# Altium project ELLO 2M.PrjPcb
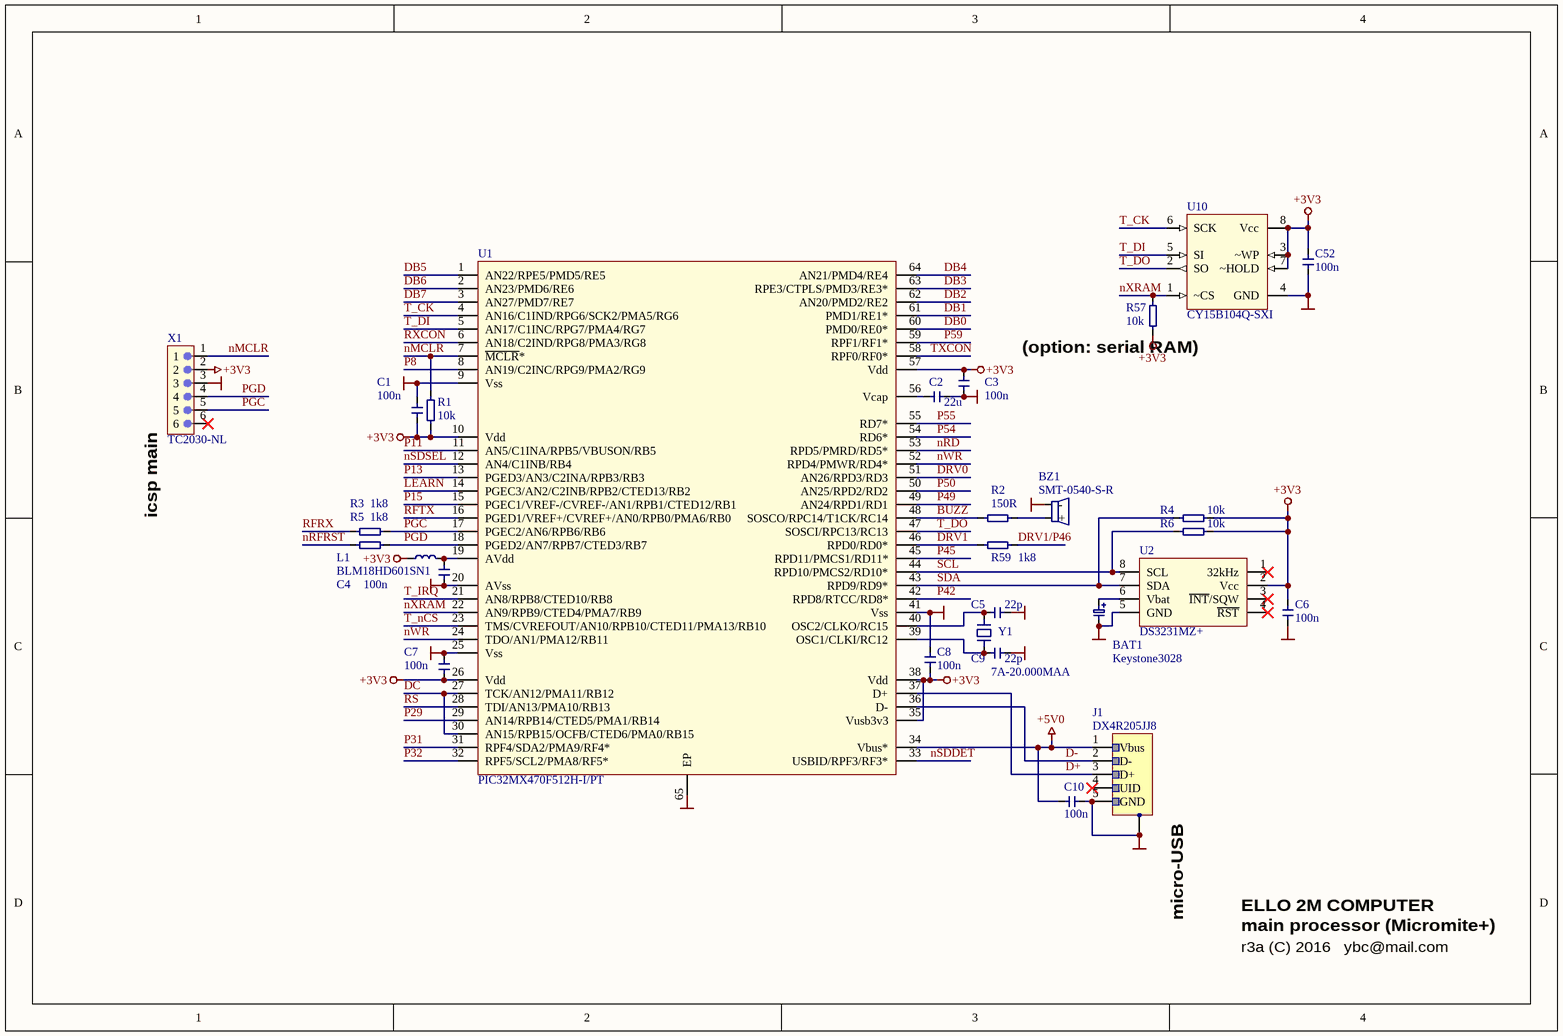
[diagram p0: main.SchDoc]
4 sheets, 231 parts. Net scope: global (net labels, ports and power ports of the same name join across sheets).
Board file: PCB1.PcbDoc
Sheets:
  main.SchDoc
  expansions.SchDoc
  keyboard.SchDoc
  video.SchDoc

## Sheet main.SchDoc
size A4

### Parts
BAT1  Keystone3028  [KEYSTONE3028/34]
BZ1  SMT-0540-S-R  [SMT-0540-S-R]
C1  100n  [_0603]
C2  22u  [_1206]
C3  100n  [_0603]
C4  100n  [_0603]
C5  22p  [_0603]
C6  100n  [_0603]
C7  100n  [_0603]
C8  100n  [_0603]
C9  22p  [_0603]
C10  100n  [_0603]
C52  100n  [_0603]
J1  DX4R205JJ8  [DX4R205JJ8]
L1  BLM18HD601SN1  [_0603]
R1  10k  [_0603]
R2  150R  [_0603]
R3  1k8  [_0603]
R4  10k  [_0603]
R5  1k8  [_0603]
R6  10k  [_0603]
R57  10k  [_0603]
R59  1k8  [_0603]
U1  PIC32MX470F512H-I/PT  [QFP50P1200X1200X120-65N-S600]
U2  DS3231MZ+  [SOIC8]
U10  CY15B104Q-SXI  [SOIC127P790X216-8N]
X1  TC2030-NL  [TC2030-NL]  (no BOM)
Y1  7A-20.000MAA  [Crystal 50x32 (2)]

### Nets
+3V3: C1.2 C3.1 C6.1 C7.2 C8.2 C52.2 L1.1 R1.1 R4.2 R6.2 R57.1 U1.10(Vdd) U1.26(Vdd) U1.35(Vusb3v3) U1.38(Vdd) U1.57(Vdd) U2.2(Vcc) U10.3(~WP) U10.7(~HOLD) U10.8(Vcc) X1.2
+5V0: C10.2 J1.1(Vbus) U1.34(Vbus*)
GND: BAT1.- BZ1.2(-) C1.1 C2.1 C3.2 C4.2 C5.2 C6.2 C7.1 C8.1 C9.2 C10.1 C52.1 J1.5(GND) U1.9(Vss) U1.20(AVss) U1.25(Vss) U1.41(Vss) U1.65(EP) U2.5(GND) U10.4(GND) X1.3
BUZZ: R2.1 U1.48(SOSCO/RPC14/T1CK/RC14)
D+: J1.3(D+) U1.37(D+)
D-: J1.2(D-) U1.36(D-)
DB0: U1.60(PMD0/RE0*)
DB1: U1.61(PMD1/RE1*)
DB2: U1.62(AN20/PMD2/RE2)
DB3: U1.63(RPE3/CTPLS/PMD3/RE3*)
DB4: U1.64(AN21/PMD4/RE4)
DB5: U1.1(AN22/RPE5/PMD5/RE5)
DB6: U1.2(AN23/PMD6/RE6)
DB7: U1.3(AN27/PMD7/RE7)
DC: U1.27(TCK/AN12/PMA11/RB12) U1.30(AN15/RPB15/OCFB/CTED6/PMA0/RB15)
DRV0: U1.51(AN26/RPD3/RD3)
DRV1: R59.2 U1.46(RPD0/RD0*)
DRV1/P46: R59.1
LEARN: U1.14(PGEC3/AN2/C2INB/RPB2/CTED13/RB2)
nMCLR: R1.2 U1.7(~{MCLR}*) X1.1
nRD: U1.53(RPD5/PMRD/RD5*)
nRFRST: R5.1
nSDDET: U1.33(USBID/RPF3/RF3*)
nSDSEL: U1.12(AN4/C1INB/RB4)
nWR: U1.24(TDO/AN1/PMA12/RB11) U1.52(RPD4/PMWR/RD4*)
nXRAM: R57.2 U1.22(AN9/RPB9/CTED4/PMA7/RB9) U10.1(~CS)
P8: U1.8(AN19/C2INC/RPG9/PMA2/RG9)
P11: U1.11(AN5/C1INA/RPB5/VBUSON/RB5)
P13: U1.13(PGED3/AN3/C2INA/RPB3/RB3)
P15: U1.15(PGEC1/VREF-/CVREF-/AN1/RPB1/CTED12/RB1)
P29: U1.29(AN14/RPB14/CTED5/PMA1/RB14)
P31: U1.31(RPF4/SDA2/PMA9/RF4*)
P32: U1.32(RPF5/SCL2/PMA8/RF5*)
P42: U1.42(RPD8/RTCC/RD8*)
P45: U1.45(RPD11/PMCS1/RD11*)
P49: U1.49(AN24/RPD1/RD1)
P50: U1.50(AN25/RPD2/RD2)
P54: U1.54(RD6*)
P55: U1.55(RD7*)
P59: U1.59(RPF1/RF1*)
PGC: R3.2 U1.17(PGEC2/AN6/RPB6/RB6) X1.5
PGD: R5.2 U1.18(PGED2/AN7/RPB7/CTED3/RB7) X1.4
RFRX: R3.1
RFTX: U1.16(PGED1/VREF+/CVREF+/AN0/RPB0/PMA6/RB0)
RS: U1.28(TDI/AN13/PMA10/RB13)
RXCON: U1.6(AN18/C2IND/RPG8/PMA3/RG8)
SCL: R6.1 U1.44(RPD10/PMCS2/RD10*) U2.8(SCL)
SDA: R4.1 U1.43(RPD9/RD9*) U2.7(SDA)
T_CK: U1.4(AN16/C1IND/RPG6/SCK2/PMA5/RG6) U10.6(SCK)
T_DI: U1.5(AN17/C1INC/RPG7/PMA4/RG7) U10.5(SI)
T_DO: U1.47(SOSCI/RPC13/RC13) U10.2(SO)
T_IRQ: U1.21(AN8/RPB8/CTED10/RB8)
T_nCS: U1.23(TMS/CVREFOUT/AN10/RPB10/CTED11/PMA13/RB10)
TXCON: U1.58(RPF0/RF0*)
NetBAT1_+: BAT1.+ U2.6(Vbat)
NetBZ1_1: BZ1.1(+) R2.2
NetC2_2: C2.2 U1.56(Vcap)
NetC4_1: C4.1 L1.2 U1.19(AVdd)
NetC5_1: C5.1 U1.40(OSC2/CLKO/RC15) Y1.2
NetC9_1: C9.1 U1.39(OSC1/CLKI/RC12) Y1.1

Not connected (* = marked no-connect by the designer): J1 4(UID)*; U2 1(32kHz)* 3(~{INT}/SQW)* 4(~{RST})*; X1 6*

### Notes on the sheet
- (option: serial RAM)
- (near X1) icsp main
- (near J1) micro-USB
- ELLO 2M COMPUTER
- r3a (C) 2016   ybc@mail.com
- main processor (Micromite+)

### Library data of the parts
BAT1 = Capacitor+: Polar capacitor
BZ1 = Speaker: Speaker/Buzzer
C1-C10 C52 = Capacitor
J1 = Mini/Micro USB: MicroUSB type A/B, 5 Position SMT Right Angle Receptacle
L1 = Inductor
R1-R6 R57 R59 = Resistor
U1 = PIC32MX4xx: 32-bit Microcontrollers (up to 512 KB Flash and 128 KB SRAM)  with Audio/Graphics/Touch (HMI), USB, and Advanced Analog; Manufacturer: Microchip; Similar Series: MX330/350/370/430/450/470
U2 = DS3231: I2C Real-Time Clock; Manufacturer: Maxim Integrated; Note: DS3232 is pin-compatible with DS3231
U10 = SPI Flash 8pin: Standard 8-pin SPI flash memory
X1 = TC2030: TC2030 nails connector; Manufacturer: www.tag-connect.com
Y1 = Crystal: Crystal Resonator

## Sheet expansions.SchDoc
size A4
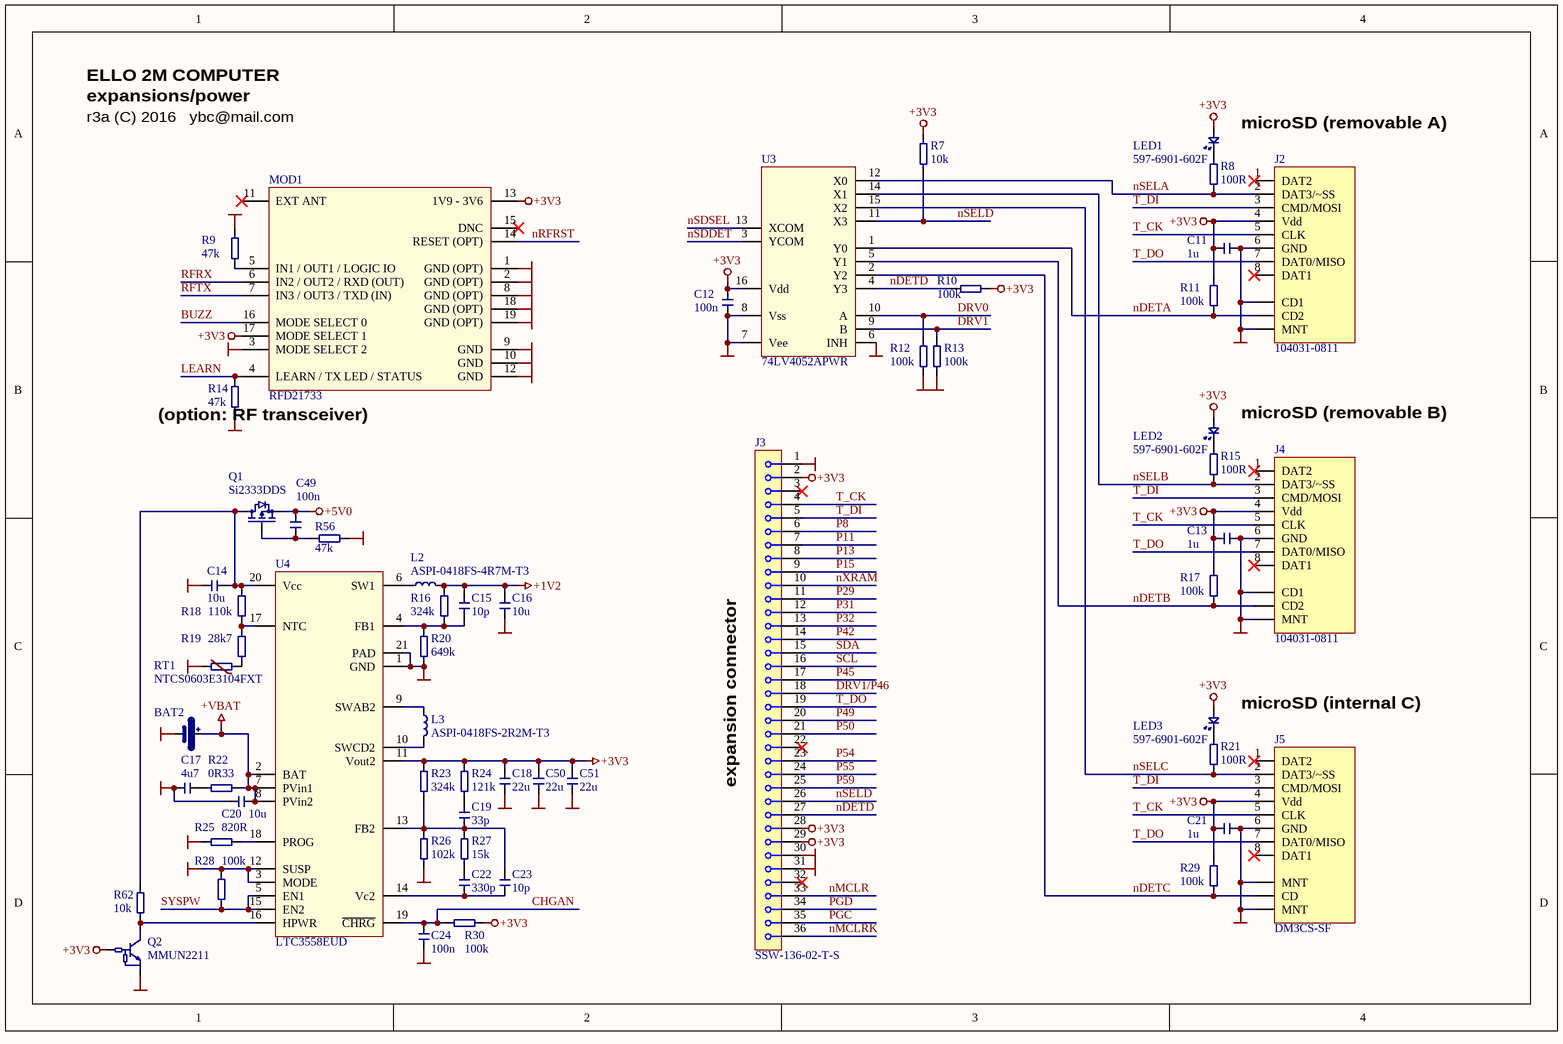
[diagram p1: expansions.SchDoc]

### Parts
BAT2  Battery  [Bat_Holder1]  (value not drawn)
C11  1u  [_0603]
C12  100n  [_0603]
C13  1u  [_0603]
C14  10u  [_1206]
C15  10p  [_0603]
C16  10u  [_1206]
C17  4u7  [_1206]
C18  22u  [_1206]
C19  33p  [_0603]
C20  10u  [_1206]
C21  1u  [_0603]
C22  330p  [_0603]
C23  10p  [_0603]
C24  100n  [_0603]
C49  100n  [_0603]
C50  22u  [_1206]
C51  22u  [_1206]
J2  104031-0811  [MOLEX_104031]
J3  SSW-136-02-T-S  [SSW-136-02-T-S]
J4  104031-0811  [MOLEX_104031]
J5  DM3CS-SF  [DM3CS-SF]
L2  ASPI-0418FS-4R7M-T3  [IND_4x4]
L3  ASPI-0418FS-2R2M-T3  [IND_4x4]
LED1  597-6901-602F  [LED1206 BOTTOM ENTRY]
LED2  597-6901-602F  [LED1206 BOTTOM ENTRY]
LED3  597-6901-602F  [LED1206 BOTTOM ENTRY]
MOD1  RFD21733  [RFDP8]
Q1  Si2333DDS  [SOT23-3]
Q2  MMUN2211  [SOT23-3]
R7  10k  [_0603]
R8  100R  [_0603]
R9  47k  [_0603]
R10  100k  [_0603]
R11  100k  [_0603]
R12  100k  [_0603]
R13  100k  [_0603]
R14  47k  [_0603]
R15  100R  [_0603]
R16  324k  [_0603]
R17  100k  [_0603]
R18  110k  [_0603]
R19  28k7  [_0603]
R20  649k  [_0603]
R21  100R  [_0603]
R22  0R33  [_1206]
R23  324k  [_0603]
R24  121k  [_0603]
R25  820R  [_0603]
R26  102k  [_0603]
R27  15k  [_0603]
R28  100k  [_0603]
R29  100k  [_0603]
R30  100k  [_0603]
R56  47k  [_0603]
R62  10k  [_0603]
RT1  NTCS0603E3104FXT  [_0603]
U3  74LV4052APWR  [SOP65P640X120-16N]
U4  LTC3558EUD  [QFN40P300X300X70_HS-21N]

### Nets
+1V2: C15.2 C16.2 L2.1 R16.1
+3V3: C11.1 C12.2 C13.1 C18.2 C21.1 C50.2 C51.2 J2.4(Vdd) J3.2 J3.28 J3.29 J4.4(Vdd) J5.4(Vdd) LED1.2 LED2.2 LED3.2 MOD1.13(1V9_-_3V6) MOD1.17(MODE_SELECT_1) Q2.1(B) R7.2 R10.2 R11.1 R17.1 R23.1 R24.1 R29.1 R30.2 U3.16(Vdd) U4.11(Vout2)
+5V0: C49.2 Q1.2(S)
+VBAT: BAT2.1 C20.2 R22.2 U4.2(BAT) U4.7(PVin1) U4.8(PVin2)
GND: BAT2.2 C11.2 C12.1 C13.2 C14.2 C16.1 C17.1 C18.1 C20.1 C21.2 C24.2 C50.1 C51.1 J2.6(GND) J2.CD1 J2.MNT J3.1 J3.30 J3.31 J4.6(GND) J4.CD1 J4.MNT J5.0(MNT) J5.6(GND) MOD1.1(GND_(OPT)) MOD1.2(GND_(OPT)) MOD1.3(MODE_SELECT_2) MOD1.8(GND_(OPT)) MOD1.9(GND) MOD1.10(GND) MOD1.12(GND) MOD1.18(GND_(OPT)) MOD1.19(GND_(OPT)) Q2.2(E) R9.2 R12.1 R13.1 R14.1 R20.2 R25.1 R26.2 R28.1 R56.2 RT1.2 U3.6(INH) U3.7(Vee) U3.8(Vss) U4.1(GND) U4.3(MODE) U4.12(SUSP) U4.21(PAD)
BUZZ: MOD1.16(MODE_SELECT_0)
CHGAN: C24.1 R30.1 U4.19(~{CHRG})
DRV0: R12.2 U3.10(A)
DRV1: R13.2 U3.9(B)
DRV1/P46: J3.18
LEARN: MOD1.4(LEARN_/_TX_LED_/_STATUS) R14.2
nDETA: J2.CD2 R11.2 U3.1(Y0)
nDETB: J4.CD2 R17.2 U3.5(Y1)
nDETC: J5.CD R29.2 U3.2(Y2)
nDETD: J3.27 R10.1 U3.4(Y3)
nMCLR: J3.33
nMCLRK: J3.36
nRFRST: MOD1.14(RESET_(OPT))
nSDDET: U3.3(YCOM)
nSDSEL: U3.13(XCOM)
nSELA: J2.2(DAT3/~SS) R8.2 U3.12(X0)
nSELB: J4.2(DAT3/~SS) R15.2 U3.14(X1)
nSELC: J5.2(DAT3/~SS) R21.2 U3.15(X2)
nSELD: J3.26 R7.1 U3.11(X3)
nXRAM: J3.10
P8: J3.6
P11: J3.7
P13: J3.8
P15: J3.9
P29: J3.11
P31: J3.12
P32: J3.13
P42: J3.14
P45: J3.17
P49: J3.20
P50: J3.21
P54: J3.23
P55: J3.24
P59: J3.25
PGC: J3.35
PGD: J3.34
RFRX: MOD1.6(IN2_/_OUT2_/_RXD_(OUT))
RFTX: MOD1.7(IN3_/_OUT3_/_TXD_(IN))
SCL: J3.16
SDA: J3.15
SYSPW: R28.2 U4.5(EN1) U4.15(EN2)
T_CK: J2.5(CLK) J3.4 J4.5(CLK) J5.5(CLK)
T_DI: J2.3(CMD/MOSI) J3.5 J4.3(CMD/MOSI) J5.3(CMD/MOSI)
T_DO: J2.7(DAT0/MISO) J3.19 J4.7(DAT0/MISO) J5.7(DAT0/MISO)
NetC14_1: C14.1 Q1.3(D) R18.1 R62.1 U4.20(Vcc)
NetC15_1: C15.1 R16.2 R20.1 U4.4(FB1)
NetC17_2: C17.2 R22.1
NetC19_1: C19.1 C23.2 R23.2 R26.1 R27.1 U4.13(FB2)
NetC19_2: C19.2 R24.2
NetC22_1: C22.1 C23.1 U4.14(Vc2)
NetC22_2: C22.2 R27.2
NetC49_1: C49.1 Q1.1(G) R56.1
NetL2_2: L2.2 U4.6(SW1)
NetL3_1: L3.1 U4.10(SWCD2)
NetL3_2: L3.2 U4.9(SWAB2)
NetLED1_1: LED1.1 R8.1
NetLED2_1: LED2.1 R15.1
NetLED3_1: LED3.1 R21.1
NetMOD1_5: MOD1.5(IN1_/_OUT1_/_LOGIC_IO) R9.1
NetQ2_3: Q2.3(C) R62.2 U4.16(HPWR)
NetR18_2: R18.2 R19.1 U4.17(NTC)
NetR19_2: R19.2 RT1.1
NetR25_2: R25.2 U4.18(PROG)

Not connected (* = marked no-connect by the designer): J2 1(DAT2)* 8(DAT1)*; J3 3* 22* 32*; J4 1(DAT2)* 8(DAT1)*; J5 1(DAT2)* 8(DAT1)*; MOD1 11(EXT_ANT)* 15(DNC)*

### Notes on the sheet
- ELLO 2M COMPUTER
- expansions/power
- r3a (C) 2016   ybc@mail.com
- microSD (removable A)
- (near MOD1) (option: RF transceiver)
- microSD (removable B)
- microSD (internal C)
- (near J3) expansion connector

### Library data of the parts
C11-C24 C49-C51 = Capacitor
J2 J4 J5 = microSD (w/ card detect): microSD card connector
J3 = Connector 1x36: Single row, 36-way connector
L2 L3 = Inductor
LED1-LED3 = LED: Light Emitting Diode
MOD1 = RFDP8: Complete 2.4GHz RF transceiver module with built-in RFDP8 application protocol; Manufacturer: RF Digital; Defined by: Dimitech Ltd; Series: RFD2173x; Similar: *; URL: www.rfdigital.com
Q1 = P-FET: P-channel FET transistor
Q2 = NPN BIASED: NPN biased bipolar transistor
R7-R30 R56 R62 = Resistor
RT1 = Thermistor
U3 = 4052: Quad CMOS Analog Multiplexers/Demultiplexers with Logic Level Conversion
U4 = LTC3558: Linear USB Battery Charger with Buck and Buck-Boost Regulators; Manufacturer: Linear

## Sheet keyboard.SchDoc
size A4
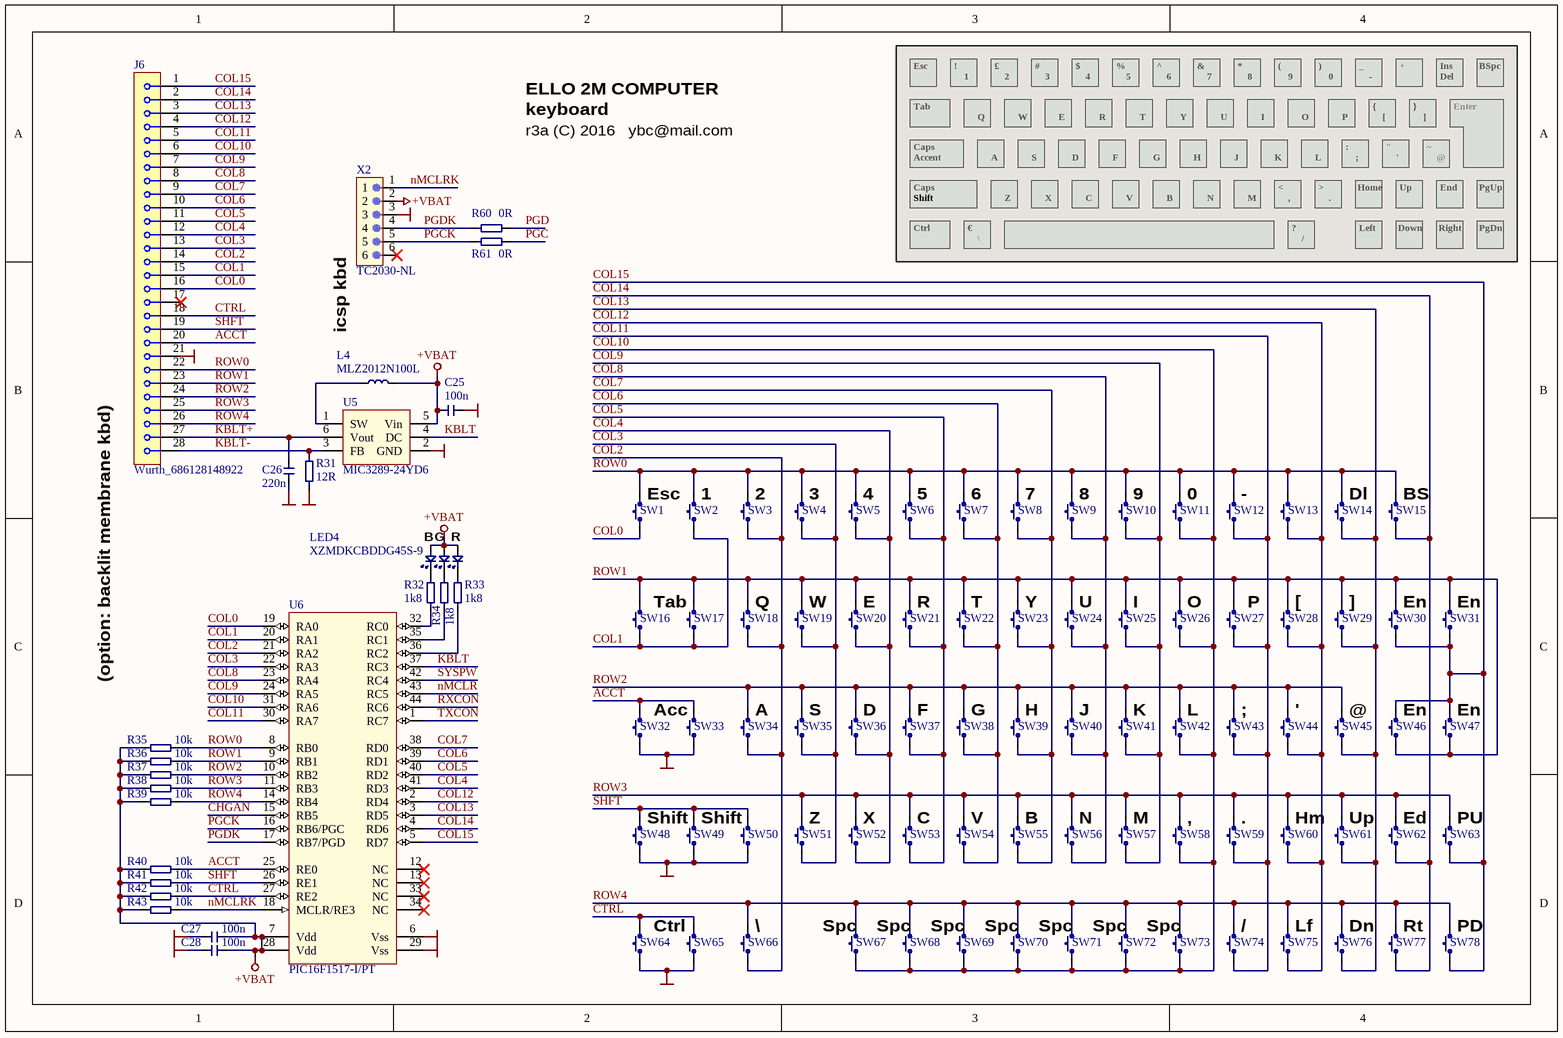
[diagram p2: keyboard.SchDoc]

### Parts
C25  100n  [_0603]
C26  220n  [_0603]
C27  100n  [_0603]
C28  100n  [_0603]
J6  Wurth_686128148922  [Wurth_686128148922]
L4  MLZ2012N100L  [_0805_IND]
LED4  XZMDKCBDDG45S-9  [LED RGB XZMDKCBDDG45S-9]
R31  12R  [_1206]
R32  1k8  [_0603]
R33  1k8  [_0603]
R34  1k8  [_0603]
R35  10k  [_0603]
R36  10k  [_0603]
R37  10k  [_0603]
R38  10k  [_0603]
R39  10k  [_0603]
R40  10k  [_0603]
R41  10k  [_0603]
R42  10k  [_0603]
R43  10k  [_0603]
R60  0R  [_0603]
R61  0R  [_0603]
SW1  (no value)  [Rubber Switch Pad (12mm)]  (no BOM)
SW2  (no value)  [Rubber Switch Pad (12mm)]  (no BOM)
SW3  (no value)  [Rubber Switch Pad (12mm)]  (no BOM)
SW4  (no value)  [Rubber Switch Pad (12mm)]  (no BOM)
SW5  (no value)  [Rubber Switch Pad (12mm)]  (no BOM)
SW6  (no value)  [Rubber Switch Pad (12mm)]  (no BOM)
SW7  (no value)  [Rubber Switch Pad (12mm)]  (no BOM)
SW8  (no value)  [Rubber Switch Pad (12mm)]  (no BOM)
SW9  (no value)  [Rubber Switch Pad (12mm)]  (no BOM)
SW10  (no value)  [Rubber Switch Pad (12mm)]  (no BOM)
SW11  (no value)  [Rubber Switch Pad (12mm)]  (no BOM)
SW12  (no value)  [Rubber Switch Pad (12mm)]  (no BOM)
SW13  (no value)  [Rubber Switch Pad (12mm)]  (no BOM)
SW14  (no value)  [Rubber Switch Pad (12mm)]  (no BOM)
SW15  (no value)  [Rubber Switch Pad (12mm)]  (no BOM)
SW16  (no value)  [Rubber Switch Pad (8x12mm)]  (no BOM)
SW17  (no value)  [Rubber Switch Pad (8x12mm)]  (no BOM)
SW18  (no value)  [Rubber Switch Pad (12mm)]  (no BOM)
SW19  (no value)  [Rubber Switch Pad (12mm)]  (no BOM)
SW20  (no value)  [Rubber Switch Pad (12mm)]  (no BOM)
SW21  (no value)  [Rubber Switch Pad (12mm)]  (no BOM)
SW22  (no value)  [Rubber Switch Pad (12mm)]  (no BOM)
SW23  (no value)  [Rubber Switch Pad (12mm)]  (no BOM)
SW24  (no value)  [Rubber Switch Pad (12mm)]  (no BOM)
SW25  (no value)  [Rubber Switch Pad (12mm)]  (no BOM)
SW26  (no value)  [Rubber Switch Pad (12mm)]  (no BOM)
SW27  (no value)  [Rubber Switch Pad (12mm)]  (no BOM)
SW28  (no value)  [Rubber Switch Pad (12mm)]  (no BOM)
SW29  (no value)  [Rubber Switch Pad (12mm)]  (no BOM)
SW30  (no value)  [Rubber Switch Pad (10x16mm)]  (no BOM)
SW31  (no value)  [Rubber Switch Pad (12x16mm)]  (no BOM)
SW32  (no value)  [Rubber Switch Pad (12mm)]  (no BOM)
SW33  (no value)  [Rubber Switch Pad (10x12mm)]  (no BOM)
SW34  (no value)  [Rubber Switch Pad (12mm)]  (no BOM)
SW35  (no value)  [Rubber Switch Pad (12mm)]  (no BOM)
SW36  (no value)  [Rubber Switch Pad (12mm)]  (no BOM)
SW37  (no value)  [Rubber Switch Pad (12mm)]  (no BOM)
SW38  (no value)  [Rubber Switch Pad (12mm)]  (no BOM)
SW39  (no value)  [Rubber Switch Pad (12mm)]  (no BOM)
SW40  (no value)  [Rubber Switch Pad (12mm)]  (no BOM)
SW41  (no value)  [Rubber Switch Pad (12mm)]  (no BOM)
SW42  (no value)  [Rubber Switch Pad (12mm)]  (no BOM)
SW43  (no value)  [Rubber Switch Pad (12mm)]  (no BOM)
SW44  (no value)  [Rubber Switch Pad (12mm)]  (no BOM)
SW45  (no value)  [Rubber Switch Pad (12mm)]  (no BOM)
SW46  (no value)  [Rubber Switch Pad (8x16mm)]  (no BOM)
SW47  (no value)  [Rubber Switch Pad (8x16mm)]  (no BOM)
SW48  (no value)  [Rubber Switch Pad (8x12mm)]  (no BOM)
SW49  (no value)  [Rubber Switch Pad (10X12mm)]  (no BOM)
SW50  (no value)  [Rubber Switch Pad (8x12mm)]  (no BOM)
SW51  (no value)  [Rubber Switch Pad (12mm)]  (no BOM)
SW52  (no value)  [Rubber Switch Pad (12mm)]  (no BOM)
SW53  (no value)  [Rubber Switch Pad (12mm)]  (no BOM)
SW54  (no value)  [Rubber Switch Pad (12mm)]  (no BOM)
SW55  (no value)  [Rubber Switch Pad (12mm)]  (no BOM)
SW56  (no value)  [Rubber Switch Pad (12mm)]  (no BOM)
SW57  (no value)  [Rubber Switch Pad (12mm)]  (no BOM)
SW58  (no value)  [Rubber Switch Pad (12mm)]  (no BOM)
SW59  (no value)  [Rubber Switch Pad (12mm)]  (no BOM)
SW60  (no value)  [Rubber Switch Pad (12mm)]  (no BOM)
SW61  (no value)  [Rubber Switch Pad (12mm)]  (no BOM)
SW62  (no value)  [Rubber Switch Pad (12mm)]  (no BOM)
SW63  (no value)  [Rubber Switch Pad (12mm)]  (no BOM)
SW64  (no value)  [Rubber Switch Pad (8x12mm)]  (no BOM)
SW65  (no value)  [Rubber Switch Pad (8x12mm)]  (no BOM)
SW66  (no value)  [Rubber Switch Pad (12mm)]  (no BOM)
SW67  (no value)  [Rubber Switch Pad (14x12mm)]  (no BOM)
SW68  (no value)  [Rubber Switch Pad (16x12mm)]  (no BOM)
SW69  (no value)  [Rubber Switch Pad (16x12mm)]  (no BOM)
SW70  (no value)  [Rubber Switch Pad (16x12mm)]  (no BOM)
SW71  (no value)  [Rubber Switch Pad (16x12mm)]  (no BOM)
SW72  (no value)  [Rubber Switch Pad (16x12mm)]  (no BOM)
SW73  (no value)  [Rubber Switch Pad (14x12mm)]  (no BOM)
SW74  (no value)  [Rubber Switch Pad (12mm)]  (no BOM)
SW75  (no value)  [Rubber Switch Pad (12mm)]  (no BOM)
SW76  (no value)  [Rubber Switch Pad (12mm)]  (no BOM)
SW77  (no value)  [Rubber Switch Pad (12mm)]  (no BOM)
SW78  (no value)  [Rubber Switch Pad (12mm)]  (no BOM)
U5  MIC3289-24YD6  [SOT23-6]
U6  PIC16F1517-I/PT  [QFP80P1200X1200X120-44N]
X2  TC2030-NL  [TC2030-NL]  (no BOM)

### Nets
+VBAT: C25.1 C27.2 C28.2 L4.2 LED4.2 R35.1 R36.1 R37.1 R38.1 R39.1 R40.1 R41.1 R42.1 R43.1 U5.5(Vin) U6.7(Vdd) U6.28(Vdd) X2.2
GND: C25.2 C26.1 C27.1 C28.1 J6.21 R31.2 SW32.1 SW33.1 SW48.1 SW49.1 SW50.1 SW64.1 SW65.1 U5.2(GND) U6.6(Vss) U6.29(Vss) X2.3
ACCT: J6.20 R40.2 SW32.2 SW33.2 U6.25(RE0)
CHGAN: U6.15(RB5)
COL0: J6.16 SW1.1 U6.19(RA0)
COL1: J6.15 SW2.1 SW16.1 SW17.1 U6.20(RA1)
COL2: J6.14 SW3.1 SW18.1 SW34.1 SW66.1 U6.21(RA2)
COL3: J6.13 SW4.1 SW19.1 SW35.1 SW51.1 U6.22(RA3)
COL4: J6.12 SW5.1 SW20.1 SW36.1 SW52.1 U6.41(RD3)
COL5: J6.11 SW6.1 SW21.1 SW37.1 SW53.1 U6.40(RD2)
COL6: J6.10 SW7.1 SW22.1 SW38.1 SW54.1 U6.39(RD1)
COL7: J6.9 SW8.1 SW23.1 SW39.1 SW55.1 U6.38(RD0)
COL8: J6.8 SW9.1 SW24.1 SW40.1 SW56.1 U6.23(RA4)
COL9: J6.7 SW10.1 SW25.1 SW41.1 SW57.1 U6.24(RA5)
COL10: J6.6 SW11.1 SW26.1 SW42.1 SW58.1 SW67.1 SW68.1 SW69.1 SW70.1 SW71.1 SW72.1 SW73.1 U6.31(RA6)
COL11: J6.5 SW12.1 SW27.1 SW43.1 SW59.1 SW74.1 U6.30(RA7)
COL12: J6.4 SW13.1 SW28.1 SW44.1 SW60.1 SW75.1 U6.2(RD4)
COL13: J6.3 SW14.1 SW29.1 SW45.1 SW61.1 SW76.1 U6.3(RD5)
COL14: J6.2 SW15.1 SW62.1 SW77.1 U6.4(RD6)
COL15: J6.1 SW30.1 SW31.1 SW46.2 SW47.2 SW63.1 SW78.1 U6.5(RD7)
CTRL: J6.18 R42.2 SW64.2 SW65.2 U6.27(RE2)
KBLT: U5.4(DC) U6.37(RC3)
KBLT+: C26.2 J6.27 U5.6(Vout)
KBLT-: J6.28 R31.1 U5.3(FB)
nMCLR: U6.43(RC5)
nMCLRK: R43.2 U6.18(MCLR/RE3) X2.1
PGC: R61.1
PGCK: R61.2 U6.16(RB6/PGC) X2.5
PGD: R60.1
PGDK: R60.2 U6.17(RB7/PGD) X2.4
ROW0: J6.22 R35.2 SW1.2 SW2.2 SW3.2 SW4.2 SW5.2 SW6.2 SW7.2 SW8.2 SW9.2 SW10.2 SW11.2 SW12.2 SW13.2 SW14.2 SW15.2 U6.8(RB0)
ROW1: J6.23 R36.2 SW16.2 SW17.2 SW18.2 SW19.2 SW20.2 SW21.2 SW22.2 SW23.2 SW24.2 SW25.2 SW26.2 SW27.2 SW28.2 SW29.2 SW30.2 SW31.2 SW46.1 SW47.1 U6.9(RB1)
ROW2: J6.24 R37.2 SW34.2 SW35.2 SW36.2 SW37.2 SW38.2 SW39.2 SW40.2 SW41.2 SW42.2 SW43.2 SW44.2 SW45.2 U6.10(RB2)
ROW3: J6.25 R38.2 SW51.2 SW52.2 SW53.2 SW54.2 SW55.2 SW56.2 SW57.2 SW58.2 SW59.2 SW60.2 SW61.2 SW62.2 SW63.2 U6.11(RB3)
ROW4: J6.26 R39.2 SW66.2 SW67.2 SW68.2 SW69.2 SW70.2 SW71.2 SW72.2 SW73.2 SW74.2 SW75.2 SW76.2 SW77.2 SW78.2 U6.14(RB4)
RXCON: U6.44(RC6)
SHFT: J6.19 R41.2 SW48.2 SW49.2 SW50.2 U6.26(RE1)
SYSPW: U6.42(RC4)
TXCON: U6.1(RC7)
NetL4_1: L4.1 U5.1(SW)
NetLED4_1: LED4.1 R33.2
NetLED4_3: LED4.3 R32.2
NetLED4_4: LED4.4 R34.2
NetR32_1: R32.1 U6.32(RC0)
NetR33_1: R33.1 U6.36(RC2)
NetR34_1: R34.1 U6.35(RC1)

Not connected (* = marked no-connect by the designer): J6 17*; U6 12(NC)* 13(NC)* 33(NC)* 34(NC)*; X2 6*

### Notes on the sheet
- ELLO 2M COMPUTER
- keyboard
- Esc
- Tab
- !
- 1
- £
- 2
- #
- 3
- $
- 4
- %
- 5
- ^
- 6
- &
- 7
- *
- 8
- (
- 9
- )
- 0
- _
- -
- {
- +
- }
- Ins
- Del
- Enter
- BSpc
- r3a (C) 2016   ybc@mail.com
- Accent
- Caps
- Q
- A
- W
- S
- E
- D
- R
- F
- T
- G
- Y
- H
- U
- J
- I
- K
- O
- L
- P
- :
- ;
- [
- "
- '
- ]
- ~
- @
- (near X2) icsp kbd
- Ctrl
- Shift
- €
- \
- Z
- X
- C
- V
- B
- N
- M
- <
- ,
- ?
- /
- >
- .
- Home
- Left
- Down
- Up
- Right
- End
- PgUp
- PgDn
- (near J6) (option: backlit membrane kbd)
- (near SW1) Esc
- (near SW2) 1
- (near SW3) 2
- (near SW4) 3
- (near SW5) 4
- (near SW6) 5
- (near SW7) 6
- (near SW8) 7
- (near SW9) 8
- (near SW10) 9
- (near SW11) 0
- (near SW12) -
- (near SW14) Dl
- (near SW15) BS
- (near LED4) B
- (near LED4) G
- (near LED4) R
- (near SW18) Q
- (near SW19) W
- (near SW20) E
- (near SW21) R
- (near SW22) T
- (near SW23) Y
- (near SW24) U
- (near SW25) I
- (near SW26) O
- (near SW27) P
- (near SW28) [
- (near SW29) ]
- (near SW30) En
- (near SW31) En
- Acc
- (near SW34) A
- (near SW35) S
- (near SW36) D
- (near SW37) F
- (near SW38) G
- (near SW39) H
- (near SW40) J
- (near SW41) K
- (near SW42) L
- (near SW43) ;
- (near SW44) '
- (near SW45) @
- (near SW46) En
- (near SW47) En
- (near SW51) Z
- (near SW52) X
- (near SW53) C
- (near SW54) V
- (near SW55) B
- (near SW56) N
- (near SW57) M
- (near SW58) ,
- (near SW59) .
- (near SW60) Hm
- (near SW61) Up
- (near SW62) Ed
- (near SW63) PU
- (near SW66) \
- (near SW67) Spc
- (near SW68) Spc
- (near SW69) Spc
- (near SW70) Spc
- (near SW71) Spc
- (near SW72) Spc
- (near SW73) Spc
- (near SW74) /
- (near SW75) Lf
- (near SW76) Dn
- (near SW77) Rt
- (near SW78) PD

### Library data of the parts
C25-C28 = Capacitor
J6 = Connector 1x28: Single row, 28-way connector
L4 = Inductor
LED4 = LED Triple: RGB Light Emitting Diode
R31-R43 R60 R61 = Resistor
SW1-SW78 = Switch MNO SPST: Switch, Momentary, Normal Open
U5 = MIC3289 (SOT26): White LED Driver; Manufacturer: Microchip (Micrel)
U6 = PIC16(L)F1904/07: 44-Pin Flash Microcontrollers with nanoWatt XLP Technology; Manufacturer: Microchip; Family: PIC16(L)F1906/1907
X2 = TC2030: TC2030 nails connector; Manufacturer: www.tag-connect.com

## Sheet video.SchDoc
size A4
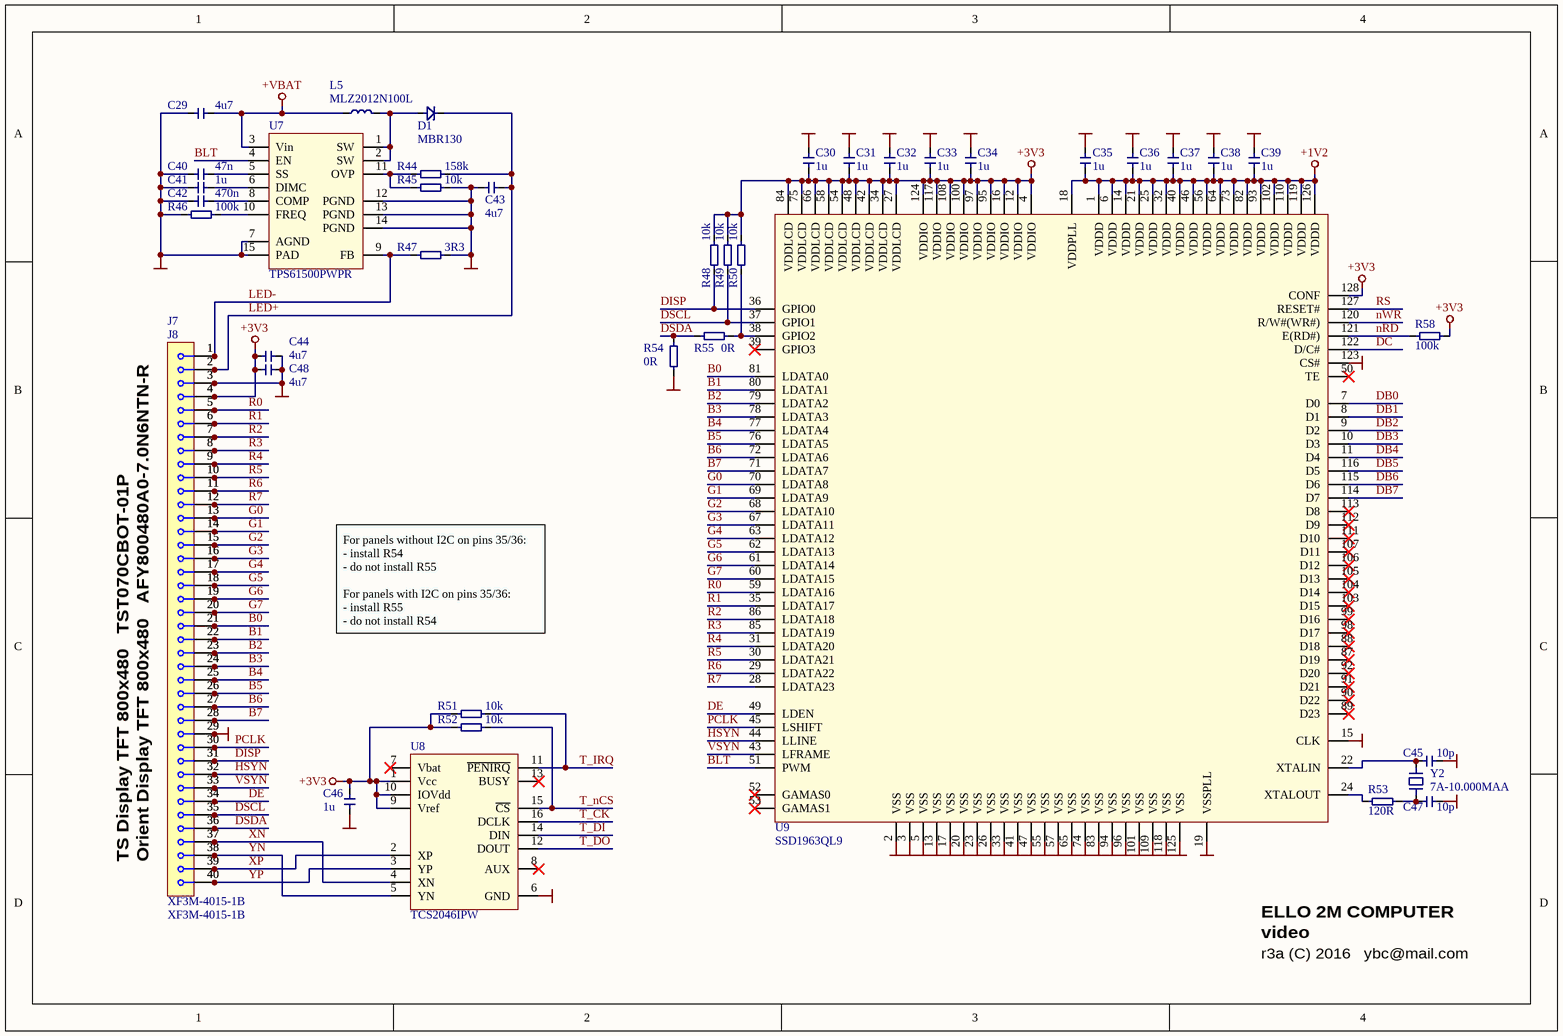
[diagram p3: video.SchDoc]

### Parts
C29  4u7  [_1206]
C30  1u  [_0603]
C31  1u  [_0603]
C32  1u  [_0603]
C33  1u  [_0603]
C34  1u  [_0603]
C35  1u  [_0603]
C36  1u  [_0603]
C37  1u  [_0603]
C38  1u  [_0603]
C39  1u  [_0603]
C40  47n  [_0603]
C41  1u  [_0603]
C42  470n  [_0603]
C43  4u7  [_1206]
C44  4u7  [_1206]
C45  10p  [_0603]
C46  1u  [_0603]
C47  10p  [_0603]
C48  4u7  [_1206]
D1  MBR130  [SOD-123]
J7  XF3M-4015-1B  [XF3M-4015-1B]
J8  XF3M-4015-1B  [XF3M-4015-1B]
L5  MLZ2012N100L  [_0805_IND]
R44  158k  [_0603]
R45  10k  [_0603]
R46  100k  [_0603]
R47  3R3  [_1206]
R48  10k  [_0603]
R49  10k  [_0603]
R50  10k  [_0603]
R51  10k  [_0603]
R52  10k  [_0603]
R53  120R  [_0603]
R54  0R  [_0603]
R55  0R  [_0603]
R58  100k  [_0603]
U7  TPS61500PWPR  [TSOP65P650X110_HS-14N]
U8  TCS2046IPW  [SOP65P640X120-16N]
U9  SSD1963QL9  [SQFP40P1600X1600-128N]
Y2  7A-10.000MAA  [Crystal 50x32 (2)]

### Nets
+1V2: C35.2 C36.2 C37.2 C38.2 C39.2 U9.1(VDDD) U9.6(VDDD) U9.14(VDDD) U9.18(VDDPLL) U9.21(VDDD) U9.25(VDDD) U9.32(VDDD) U9.40(VDDD) U9.46(VDDD) U9.56(VDDD) U9.64(VDDD) U9.73(VDDD) U9.82(VDDD) U9.93(VDDD) U9.102(VDDD) U9.110(VDDD) U9.119(VDDD) U9.126(VDDD)
+3V3: C30.2 C31.2 C32.2 C33.2 C34.2 C44.2 C46.1 C48.2 J7.4 J8.4 R48.2 R49.2 R50.2 R51.2 R52.2 R58.2 U8.1(Vcc) U8.9(Vref) U8.10(IOVdd) U9.4(VDDIO) U9.12(VDDIO) U9.16(VDDIO) U9.27(VDDLCD) U9.34(VDDLCD) U9.42(VDDLCD) U9.48(VDDLCD) U9.54(VDDLCD) U9.58(VDDLCD) U9.66(VDDLCD) U9.75(VDDLCD) U9.84(VDDLCD) U9.95(VDDIO) U9.97(VDDIO) U9.100(VDDIO) U9.108(VDDIO) U9.117(VDDIO) U9.124(VDDIO) U9.128(CONF)
+VBAT: C29.1 L5.1 U7.3(Vin)
GND: C29.2 C30.1 C31.1 C32.1 C33.1 C34.1 C35.1 C36.1 C37.1 C38.1 C39.1 C40.2 C41.2 C42.2 C43.1 C44.1 C45.2 C46.2 C47.2 C48.1 J7.3 J7.29 J8.3 J8.29 R45.2 R46.2 R47.1 R54.2 U7.7(AGND) U7.12(PGND) U7.13(PGND) U7.14(PGND) U7.15(PAD) U8.6(GND) U9.2(VSS) U9.3(VSS) U9.5(VSS) U9.13(VSS) U9.15(CLK) U9.17(VSS) U9.19(VSSPLL) U9.20(VSS) U9.23(VSS) U9.26(VSS) U9.33(VSS) U9.41(VSS) U9.47(VSS) U9.55(VSS) U9.57(VSS) U9.65(VSS) U9.74(VSS) U9.83(VSS) U9.94(VSS) U9.96(VSS) U9.101(VSS) U9.109(VSS) U9.118(VSS) U9.123(CS#) U9.125(VSS)
B0: J7.21 J8.21 U9.81(LDATA0)
B1: J7.22 J8.22 U9.80(LDATA1)
B2: J7.23 J8.23 U9.79(LDATA2)
B3: J7.24 J8.24 U9.78(LDATA3)
B4: J7.25 J8.25 U9.77(LDATA4)
B5: J7.26 J8.26 U9.76(LDATA5)
B6: J7.27 J8.27 U9.72(LDATA6)
B7: J7.28 J8.28 U9.71(LDATA7)
BLT: U7.4(EN) U9.51(PWM)
DB0: U9.7(D0)
DB1: U9.8(D1)
DB2: U9.9(D2)
DB3: U9.10(D3)
DB4: U9.11(D4)
DB5: U9.116(D5)
DB6: U9.115(D6)
DB7: U9.114(D7)
DC: U9.122(D/C#)
DE: J7.34 J8.34 U9.49(LDEN)
DISP: J7.31 J8.31 R48.1 U9.36(GPIO0)
DSCL: J7.35 J8.35 R49.1 U9.37(GPIO1)
DSDA: J7.36 J8.36 R54.1 R55.2
G0: J7.13 J8.13 U9.70(LDATA8)
G1: J7.14 J8.14 U9.69(LDATA9)
G2: J7.15 J8.15 U9.68(LDATA10)
G3: J7.16 J8.16 U9.67(LDATA11)
G4: J7.17 J8.17 U9.63(LDATA12)
G5: J7.18 J8.18 U9.62(LDATA13)
G6: J7.19 J8.19 U9.61(LDATA14)
G7: J7.20 J8.20 U9.60(LDATA15)
HSYN: J7.32 J8.32 U9.44(LLINE)
LED+: C43.2 D1.1 J7.2 J8.2 R44.2
LED-: J7.1 J8.1 R47.2 U7.9(FB)
nRD: R58.1 U9.121(E(RD#))
nWR: U9.120(R/W#(WR#))
PCLK: J7.30 J8.30 U9.45(LSHIFT)
R0: J7.5 J8.5 U9.59(LDATA16)
R1: J7.6 J8.6 U9.35(LDATA17)
R2: J7.7 J8.7 U9.86(LDATA18)
R3: J7.8 J8.8 U9.85(LDATA19)
R4: J7.9 J8.9 U9.31(LDATA20)
R5: J7.10 J8.10 U9.30(LDATA21)
R6: J7.11 J8.11 U9.29(LDATA22)
R7: J7.12 J8.12 U9.28(LDATA23)
RS: U9.127(RESET#)
T_CK: U8.16(DCLK)
T_DI: U8.14(DIN)
T_DO: U8.12(DOUT)
T_IRQ: R51.1 U8.11(~{PENIRQ})
T_nCS: R52.1 U8.15(~{CS})
VSYN: J7.33 J8.33 U9.43(LFRAME)
XN: J7.37 J8.37 U8.4(XN)
XP: J7.39 J8.39 U8.2(XP)
YN: J7.38 J8.38 U8.5(YN)
YP: J7.40 J8.40 U8.3(YP)
NetC40_1: C40.1 U7.5(SS)
NetC41_1: C41.1 U7.6(DIMC)
NetC42_1: C42.1 U7.8(COMP)
NetC45_1: C45.1 U9.22(XTALIN) Y2.2
NetC47_1: C47.1 R53.1 Y2.1
NetD1_2: D1.2 L5.2 U7.1(SW) U7.2(SW)
NetR44_1: R44.1 R45.1 U7.11(OVP)
NetR46_1: R46.1 U7.10(FREQ)
NetR50_1: R50.1 R55.1 U9.38(GPIO2)
NetR53_2: R53.2 U9.24(XTALOUT)

Not connected (* = marked no-connect by the designer): U8 7(Vbat)* 8(AUX)* 13(BUSY)*; U9 39(GPIO3)* 50(TE)* 52(GAMAS0)* 53(GAMAS1)* 87(D19)* 88(D18)* 89(D23)* 90(D22)* 91(D21)* 92(D20)* 98(D17)* 99(D16)* 103(D15)* 104(D14)* 105(D13)* 106(D12)* 107(D11)* 111(D10)* 112(D9)* 113(D8)*

### Notes on the sheet
- For panels without I2C on pins 35/36:
  - install R54
  - do not install R55
  For panels with I2C on pins 35/36:
  - install R55
  - do not install R54
- TS Display TFT 800x480   TST070CBOT-01P
- Orient Display TFT 800x480   AFY800480A0-7.0N6NTN-R
- ELLO 2M COMPUTER
- r3a (C) 2016   ybc@mail.com
- video

### Library data of the parts
C29-C48 = Capacitor
D1 = Diode Schottky: Schottky diode
J7 J8 = Connector 1x40: Single row, 40-way connector
L5 = Inductor
R44-R55 R58 = Resistor
U7 = TPS61500: TPS61500 3-A Boost Converter for High Brightness  LED Driver With Multiple Dimming Methods; Manufacturer: Texas Instruments
U8 = XPT2046 (TSOP16): Manufacturer: Shenzhen XPTEK Technology; URL: http://www.xptek.com.cn; Alternative: TCS2046
U9 = SSD1963Q: 1215KB Embedded Display SRAM LCD Display Controller; Manufacturer: Solomon Systech
Y2 = Crystal: Crystal Resonator

## Nets that join several sheets
+1V2: expansions (C15.2 C16.2 L2.1 R16.1), video (23 pins)
+3V3: main (21 pins), expansions (29 pins), video (38 pins)
+5V0: main (C10.2 J1.1 U1.34), expansions (C49.2 Q1.2)
+VBAT: expansions (6 pins), keyboard (18 pins), video (C29.1 L5.1 U7.3)
GND: main (22 pins), expansions (51 pins), keyboard (17 pins), video (59 pins)
BUZZ: main (R2.1 U1.48), expansions (MOD1.16)
CHGAN: expansions (C24.1 R30.1 U4.19), keyboard (U6.15)
DB0: main (U1.60), video (U9.7)
DB1: main (U1.61), video (U9.8)
DB2: main (U1.62), video (U9.9)
DB3: main (U1.63), video (U9.10)
DB4: main (U1.64), video (U9.11)
DB5: main (U1.1), video (U9.116)
DB6: main (U1.2), video (U9.115)
DB7: main (U1.3), video (U9.114)
DC: main (U1.27 U1.30), video (U9.122)
DRV0: main (U1.51), expansions (R12.2 U3.10)
DRV1: main (R59.2 U1.46), expansions (R13.2 U3.9)
DRV1/P46: main (R59.1), expansions (J3.18)
LEARN: main (U1.14), expansions (MOD1.4 R14.2)
nMCLR: main (R1.2 U1.7 X1.1), expansions (J3.33), keyboard (U6.43)
nMCLRK: expansions (J3.36), keyboard (R43.2 U6.18 X2.1)
nRD: main (U1.53), video (R58.1 U9.121)
nRFRST: main (R5.1), expansions (MOD1.14)
nSDDET: main (U1.33), expansions (U3.3)
nSDSEL: main (U1.12), expansions (U3.13)
nWR: main (U1.24 U1.52), video (U9.120)
nXRAM: main (R57.2 U1.22 U10.1), expansions (J3.10)
P8: main (U1.8), expansions (J3.6)
P11: main (U1.11), expansions (J3.7)
P13: main (U1.13), expansions (J3.8)
P15: main (U1.15), expansions (J3.9)
P29: main (U1.29), expansions (J3.11)
P31: main (U1.31), expansions (J3.12)
P32: main (U1.32), expansions (J3.13)
P42: main (U1.42), expansions (J3.14)
P45: main (U1.45), expansions (J3.17)
P49: main (U1.49), expansions (J3.20)
P50: main (U1.50), expansions (J3.21)
P54: main (U1.54), expansions (J3.23)
P55: main (U1.55), expansions (J3.24)
P59: main (U1.59), expansions (J3.25)
PGC: main (R3.2 U1.17 X1.5), expansions (J3.35), keyboard (R61.1)
PGD: main (R5.2 U1.18 X1.4), expansions (J3.34), keyboard (R60.1)
RFRX: main (R3.1), expansions (MOD1.6)
RFTX: main (U1.16), expansions (MOD1.7)
RS: main (U1.28), video (U9.127)
RXCON: main (U1.6), keyboard (U6.44)
SCL: main (R6.1 U1.44 U2.8), expansions (J3.16)
SDA: main (R4.1 U1.43 U2.7), expansions (J3.15)
SYSPW: expansions (R28.2 U4.5 U4.15), keyboard (U6.42)
T_CK: main (U1.4 U10.6), expansions (J2.5 J3.4 J4.5 J5.5), video (U8.16)
T_DI: main (U1.5 U10.5), expansions (J2.3 J3.5 J4.3 J5.3), video (U8.14)
T_DO: main (U1.47 U10.2), expansions (J2.7 J3.19 J4.7 J5.7), video (U8.12)
T_IRQ: main (U1.21), video (R51.1 U8.11)
T_nCS: main (U1.23), video (R52.1 U8.15)
TXCON: main (U1.58), keyboard (U6.1)